# EAGLE design mkr1010_envMonitor_schematic (EAGLE 9.6.2)
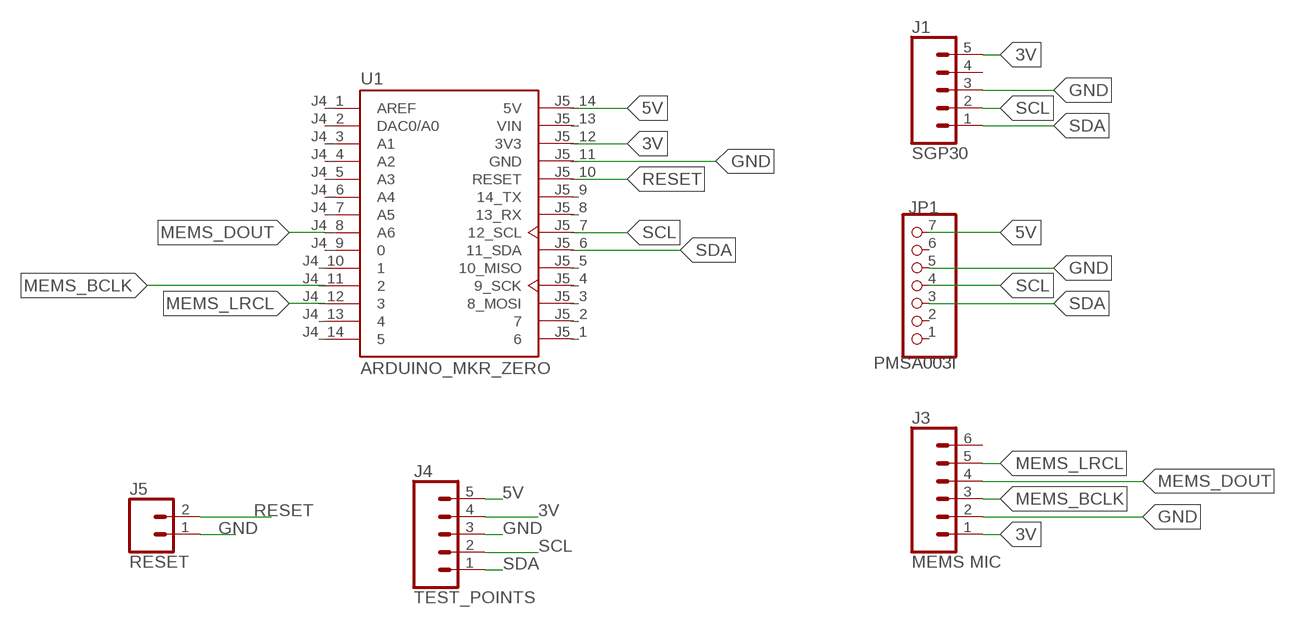
[diagram p0: schematic, sheet 1]

## Parts
J1  SGP30  CONN_05  [1X05]
J3  MEMS MIC  CONN_06SILK_FEMALE_PTH  [1X06]
J4  TEST_POINTS  CONN_05  [1X05]
J5  RESET  CONN_02  [1X02]
JP1  PMSA003I  PINHD-1X7  [1X07]
U1  ARDUINO_MKR_ZERO  [MODULE_ARDUINO_MKR_ZERO]

## Nets
3V: J1.5 J3.1 J4.4 U1.J5_12(3V3)
5V: J4.5 JP1.7 U1.J5_14(5V)
GND: J1.3 J3.2 J4.3 J5.1 JP1.5 U1.J5_11(GND)
MEMS_BCLK: J3.3 U1.J4_11
MEMS_DOUT: J3.4 U1.J4_8(A6)
MEMS_LRCL: J3.5 U1.J4_12
RESET: J5.2 U1.J5_10(RESET)
SCL: J1.2 J4.2 JP1.4 U1.J5_7(12_SCL)
SDA: J1.1 J4.1 JP1.3 U1.J5_6(11_SDA)
Unconnected: J1.4 J3.6 JP1.1 JP1.2 JP1.6 U1.J4_1(AREF) U1.J4_2(DAC0/A0) U1.J4_3(A1) U1.J4_4(A2) U1.J4_5(A3) U1.J4_6(A4) U1.J4_7(A5) U1.J4_9 U1.J4_10 U1.J4_13 U1.J4_14 U1.J5_1 U1.J5_2 U1.J5_3(8_MOSI) U1.J5_4(9_SCK) U1.J5_5(10_MISO) U1.J5_8(13_RX) U1.J5_9(14_TX)

## Power pins joined to a net without a drawn wire
VIN: U1.J5_13(VIN)

## Library data of the parts
J1 J4 = SparkFun-Connectors:CONN_05: Multi connection point. Often used as Generic Header-pin footprint for 0.1 inch spaced/style header connections On any of the 0.1 inch spaced packages, you can populate with these: Break Away Headers - Straight <https://www.sparkfun.com/products/116> (PRT-00116) Break Away Male Headers - Right Angle <https://www.sparkfun.com/products/553> (PRT-00553) Female Headers <https://www.sparkfun.com/products/115> (PRT-00115) Break Away Headers - Machine Pin <https://www.sparkfun.com/products/117> (PRT-00117) Break Away Female Headers - Swiss Machine Pin <https://www.sparkfun.com/products/743> (PRT-00743) For SCREWTERMINALS and SPRING TERMINALS visit here: Screw Terimnals on SparkFun.com <https://www.sparkfun.com/search/results?term=Screw+Terminals> (5mm/3.5mm/2.54mm spacing) This device is also useful as a general connection point to wire up your design to another part of your project. Our various solder wires solder well into these plated through hole pads. Hook-Up Wire - Assortment (Stranded, 22 AWG) <https://www.sparkfun.com/products/11375> (PRT-11375) Hook-Up Wire - Assortment (Solid Core, 22 AWG) <https://www.sparkfun.com/products/11367> (PRT-11367) View the entire wire category on our website here <https://www.sparkfun.com/categories/141> Special notes: Molex polarized connector foot print use with SKU : PRT-08231 with associated crimp pins and housings. 1MM SMD Version SKU: PRT-10208
J3 = SparkFun-Connectors:CONN_06: Multi connection point. Often used as Generic Header-pin footprint for 0.1 inch spaced/style header connections On any of the 0.1 inch spaced packages, you can populate with these: Break Away Headers - Straight <https://www.sparkfun.com/products/116> (PRT-00116) Break Away Male Headers - Right Angle <https://www.sparkfun.com/products/553> (PRT-00553) Female Headers <https://www.sparkfun.com/products/115> (PRT-00115) Break Away Headers - Machine Pin <https://www.sparkfun.com/products/117> (PRT-00117) Break Away Female Headers - Swiss Machine Pin <https://www.sparkfun.com/products/743> (PRT-00743) Arduino Stackable Header - 6 Pin <https://www.sparkfun.com/products/9280> (PRT-09280) For SCREWTERMINALS and SPRING TERMINALS visit here: Screw Terimnals on SparkFun.com <https://www.sparkfun.com/search/results?term=Screw+Terminals> (5mm/3.5mm/2.54mm spacing) This device is also useful as a general connection point to wire up your design to another part of your project. Our various solder wires solder well into these plated through hole pads. Hook-Up Wire - Assortment (Stranded, 22 AWG) <https://www.sparkfun.com/products/11375> (PRT-11375) Hook-Up Wire - Assortment (Solid Core, 22 AWG) <https://www.sparkfun.com/products/11367> (PRT-11367) View the entire wire category on our website here <https://www.sparkfun.com/categories/141>; PROD_ID: CONN-08437
J5 = SparkFun-Connectors:CONN_02: Multi connection point. Often used as Generic Header-pin footprint for 0.1 inch spaced/style header connections On any of the 0.1 inch spaced packages, you can populate with these: Break Away Headers - Straight <https://www.sparkfun.com/products/116> (PRT-00116) Break Away Male Headers - Right Angle <https://www.sparkfun.com/products/553> (PRT-00553) Female Headers <https://www.sparkfun.com/products/115> (PRT-00115) Break Away Headers - Machine Pin <https://www.sparkfun.com/products/117> (PRT-00117) Break Away Female Headers - Swiss Machine Pin <https://www.sparkfun.com/products/743> (PRT-00743) For SCREWTERMINALS and SPRING TERMINALS visit here: Screw Terimnals on SparkFun.com <https://www.sparkfun.com/search/results?term=Screw+Terminals> (5mm/3.5mm/2.54mm spacing) This device is also useful as a general connection point to wire up your design to another part of your project. Our various solder wires solder well into these plated through hole pads. Hook-Up Wire - Assortment (Stranded, 22 AWG) <https://www.sparkfun.com/products/11375> (PRT-11375) Hook-Up Wire - Assortment (Solid Core, 22 AWG) <https://www.sparkfun.com/products/11367> (PRT-11367) View the entire wire category on our website here <https://www.sparkfun.com/categories/141> Special notes: Molex polarized connector foot print use with: PRT-08233 with associated crimp pins and housings. 2.54_SCREWTERM for use with PRT-10571. 3.5mm Screw Terminal footprints for PRT-08084 5mm Screw Terminal footprints for use with PRT-08432
JP1 = pinhead:PINHD-1X7: PIN HEADER
U1 = ARDUINO_MKR_ZERO:ARDUINO_MKR_ZERO: ATSAMD21 Arduino MKR Zero with Headers SAM D ARM® Cortex®-M0+ MCU 32-Bit Embedded Evaluation Board; AVAILABILITY: Unavailable; DESCRIPTION: ATSAMD21 Arduino MKR Zero with Headers SAM D ARM® Cortex®-M0+ MCU 32-Bit Embedded Evaluation Board; MF: Arduino; MP: ARDUINO MKR ZERO; PACKAGE: None; PRICE: None

## Board
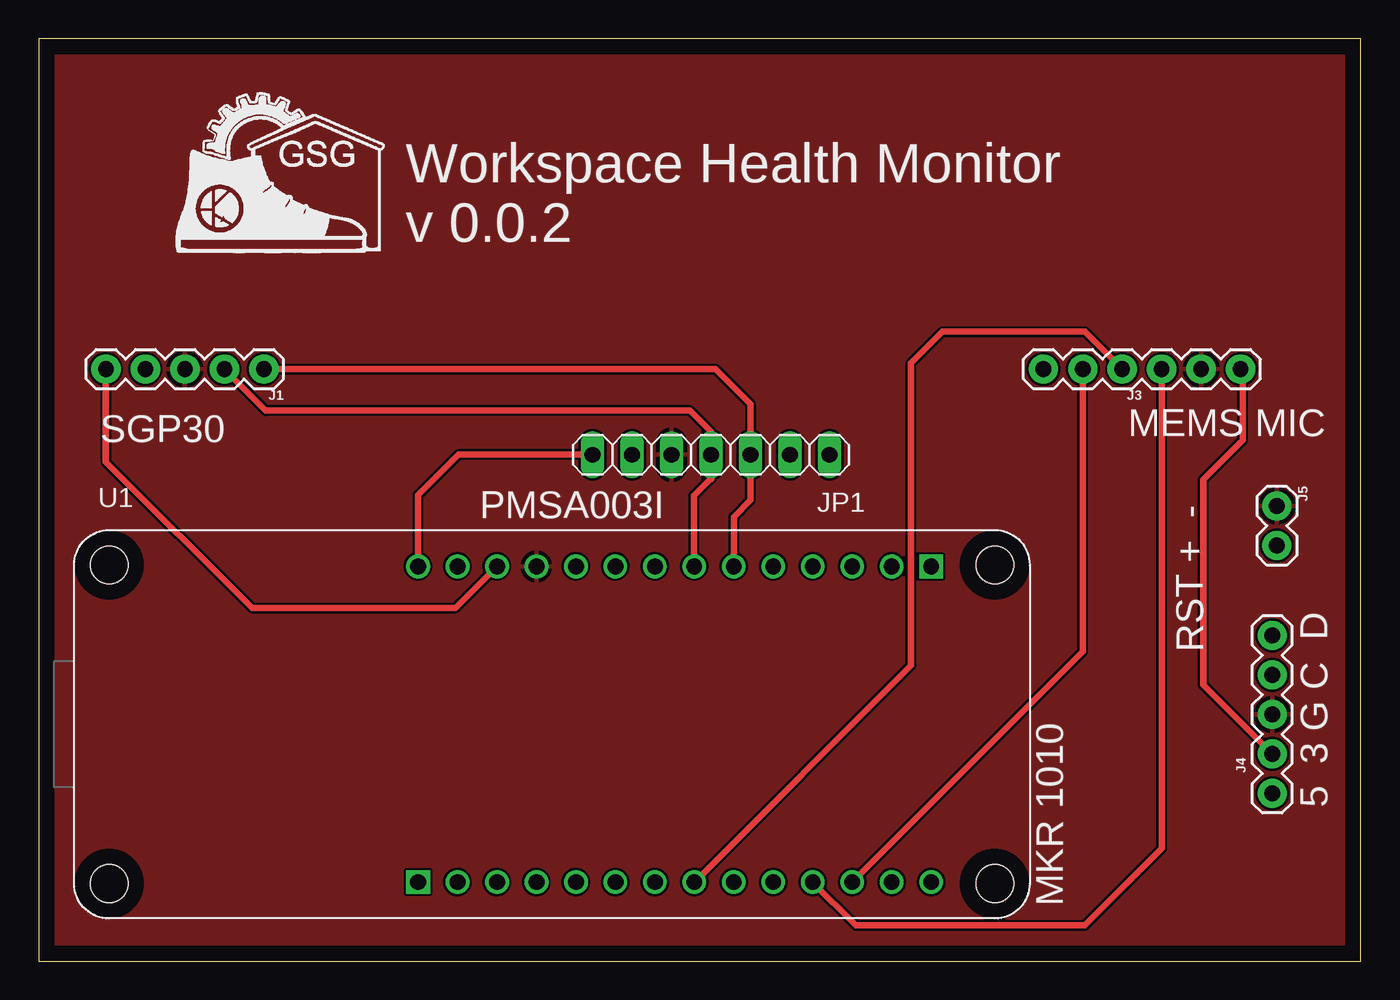
[diagram p1: board, top side]
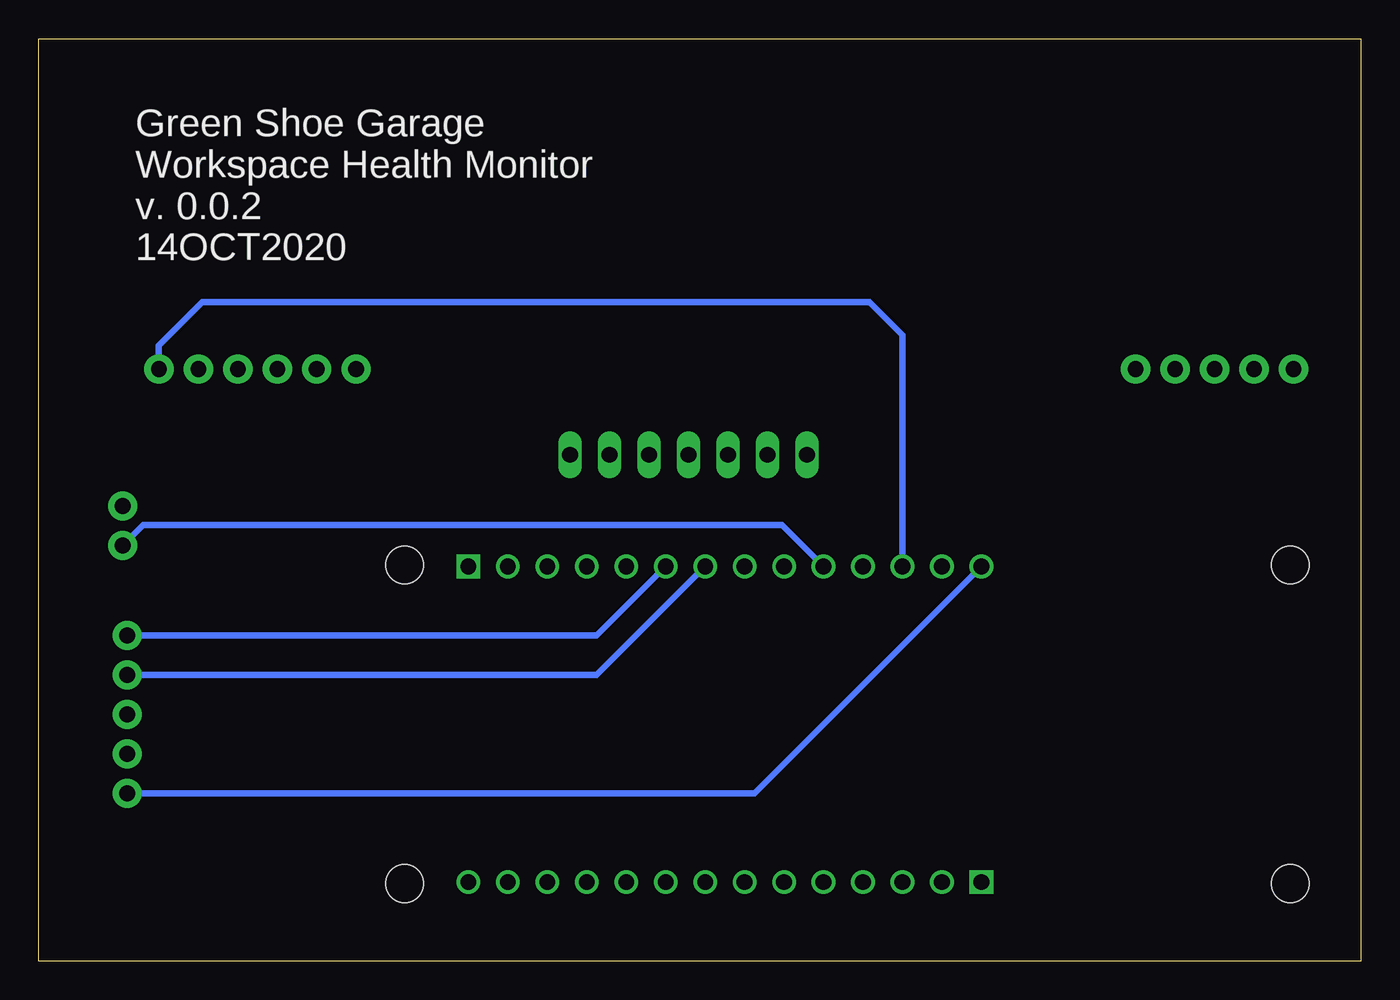
[diagram p2: board, bottom side, seen from below]

Size 85.07 x 59.36 mm. Coordinates in mm from the lower left corner, seen from the top.
Outline: 0,0 85.07,0 85.07,59.36 0,59.36 0,0
Copper layers (1*16): Top 0.035mm / dielectric 1.5mm / Bottom 0.035mm
Design rules "default": minimum track width 6mil, minimum drill 0.35mm, track to track 6mil, track to pad 6mil, pad to pad 6mil, via to via 6mil, smd to smd 6mil, copper to edge 40mil, drill to drill 6mil, minimum pad ring 10mil, minimum via ring 8mil, stop-mask expansion 4mil, vias tented up to drill 0mil, thermal gap 10mil

### Footprints (pad centres in the part's own frame; a part is rotated, then mirrored left to right if it is on the bottom)
1X05 = drill 1.016 pad 1.88: 1 0,0; 2 2.54,0; 3 5.08,0; 4 7.62,0; 5 10.16,0
1X06 = drill 1.016 pad 1.88: 1 0,0; 2 2.54,0; 3 5.08,0; 4 7.62,0; 5 10.16,0; 6 12.7,0
1X02 = drill 1.016 pad 1.88: 1 0,0; 2 2.54,0
1X07 = drill 1.016 long: 1 -7.62,0; 2 -5.08,0; 3 -2.54,0; 4 0,0; 5 2.54,0; 6 5.08,0; 7 7.62,0
MODULE_ARDUINO_MKR_ZERO = drill 1.02 square: J4_1 -8.615,-10.16; J5_1 24.405,10.16 | drill 1.02: J4_2 -6.075,-10.16; J4_3 -3.535,-10.16; J4_4 -0.995,-10.16; J4_5 1.545,-10.16; J4_6 4.085,-10.16; J4_7 6.625,-10.16; J4_8 9.165,-10.16; J4_9 11.705,-10.16; J4_10 14.245,-10.16; J4_11 16.785,-10.16; J4_12 19.325,-10.16; J4_13 21.865,-10.16; J4_14 24.405,-10.16; J5_2 21.865,10.16; J5_3 19.325,10.16; J5_4 16.785,10.16; J5_5 14.245,10.16; J5_6 11.705,10.16; J5_7 9.165,10.16; J5_8 6.625,10.16; J5_9 4.085,10.16; J5_10 1.545,10.16; J5_11 -0.995,10.16; J5_12 -3.535,10.16; J5_13 -6.075,10.16; J5_14 -8.615,10.16 | hole 2.42: -28.5,-10.25; -28.5,10.25; 28.5,10.25; 28.5,-10.25

### Placement (x,y rotation side)
J1  14.48,38.1 180 top
J3  77.34,38.1 180 top
J4  79.38,20.95 270 top
J5  79.68,29.29 270 top
JP1  43.26,32.59 180 top
U1  33.02,15.24 0 top

### Tracks (layer width: path | path; a pad name or v marks a point on that pad's centre or on a via)
3V
  Top 0.406: J1.5 4.32,32.13 13.72,22.73 26.82,22.73 U1.J5_12 | J4.4 74.93,17.78 74.93,30.99 77.47,33.53 77.47,37.97 J3.1
  Bottom 0.406: U1.J5_12 29.48,40.28 31.62,42.42 74.55,42.42 77.34,39.62 J3.1
5V
  Top 0.406: U1.J5_14 24.41,29.99 26.48,32.07 26.67,32.26 27,32.59 JP1.7
  Bottom 0.406: U1.J5_14 39.01,10.79 J4.5
GND
  pour Top: 0,59.69 0,0 85.09,0 85.09,59.69
MEMS_BCLK
  Top 0.406: U1.J4_11 52.6,2.29 67.31,2.29 72.26,7.24 J3.3
MEMS_DOUT
  Top 0.406: U1.J4_8 56.13,19.03 56.13,38.48 58.17,40.51 67.31,40.51 J3.4
MEMS_LRCL
  Top 0.406: U1.J4_12 67.18,19.92 J3.5
RESET
  Bottom 0.406: J5.2 78.35,28.07 37.24,28.07 U1.J5_10
SCL
  Top 0.406: U1.J5_7 42.16,25.42 42.16,29.97 43.23,31.04 43.28,31.04 43.28,32.56 JP1.4 43.26,34.09 41.91,35.43 14.61,35.43 J1.2
  Bottom 0.406: U1.J5_7 49.17,18.41 J4.2
SDA
  Top 0.406: U1.J5_6 44.73,28.6 45.8,29.67 JP1.3 45.8,35.87 43.56,38.1 J1.1
  Bottom 0.406: U1.J5_6 49.17,20.95 J4.1

### Text on the board
tPlace: Workspace Health Monitor / v 0.0.2 | MEMS MIC | SGP30 | RST + - | PMSA003I | 5 3 G C D | MKR 1010
bPlace: Green Shoe Garage / Workspace Health Monitor / v. 0.0.2 / 14OCT2020
200bmp: C:/Users/mpark/OneDrive/My Documents/Green Shoe Garage/GSG Images/GSG_BW.bmp